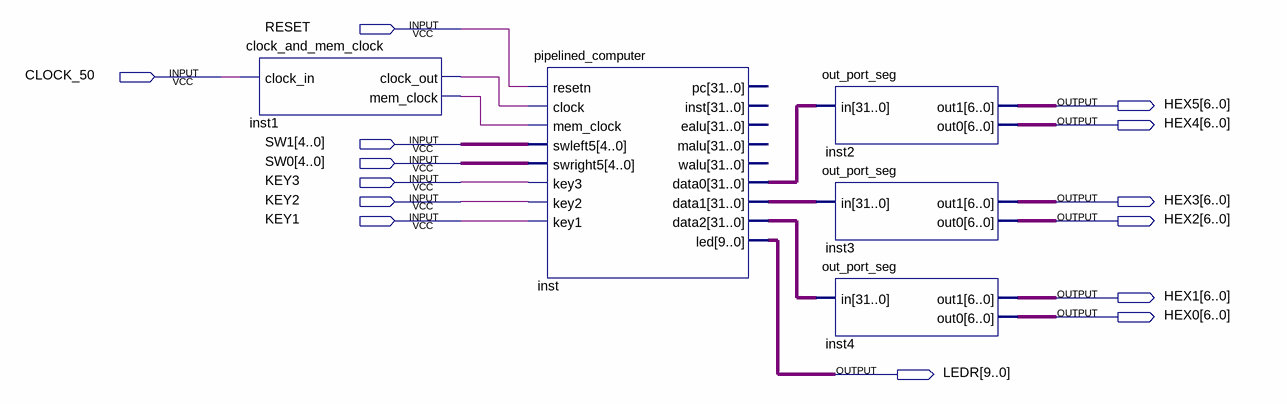
[diagram p0: schematic sheet]
// Quartus schematic pipe_computer_IO.bdf as structural Verilog: 5 symbols, 14 pins
module pipe_computer_IO (
  input  RESET,
  input  CLOCK_50,
  input  [4:0] SW1,
  input  [4:0] SW0,
  input  KEY3,
  input  KEY2,
  input  KEY1,
  output [6:0] HEX5,
  output [6:0] HEX4,
  output [6:0] HEX3,
  output [6:0] HEX2,
  output [6:0] HEX1,
  output [6:0] HEX0,
  output [9:0] LEDR
);

  wire inst1_clock_out, inst1_mem_clock;
  wire [31:0] inst_data0, inst_data1, inst_data2;

  clock_and_mem_clock inst1 (.clock_in(CLOCK_50), .clock_out(inst1_clock_out), .mem_clock(inst1_mem_clock));
  pipelined_computer inst (
    .resetn(RESET), .clock(inst1_clock_out), .mem_clock(inst1_mem_clock), .swleft5(SW1), .swright5(SW0),
    .key3(KEY3), .key2(KEY2), .key1(KEY1), .data0(inst_data0), .data1(inst_data1), .data2(inst_data2),
    .led(LEDR));  // open: pc, inst, ealu, malu, walu
  out_port_seg inst2 (.in(inst_data0), .out1(HEX5), .out0(HEX4));
  out_port_seg inst3 (.in(inst_data1), .out1(HEX3), .out0(HEX2));
  out_port_seg inst4 (.in(inst_data2), .out1(HEX1), .out0(HEX0));
endmodule
